# Altium schematic sheet 2.RELAY.SchDoc
size A4; SheetNumber: 2; SheetTotal: 5
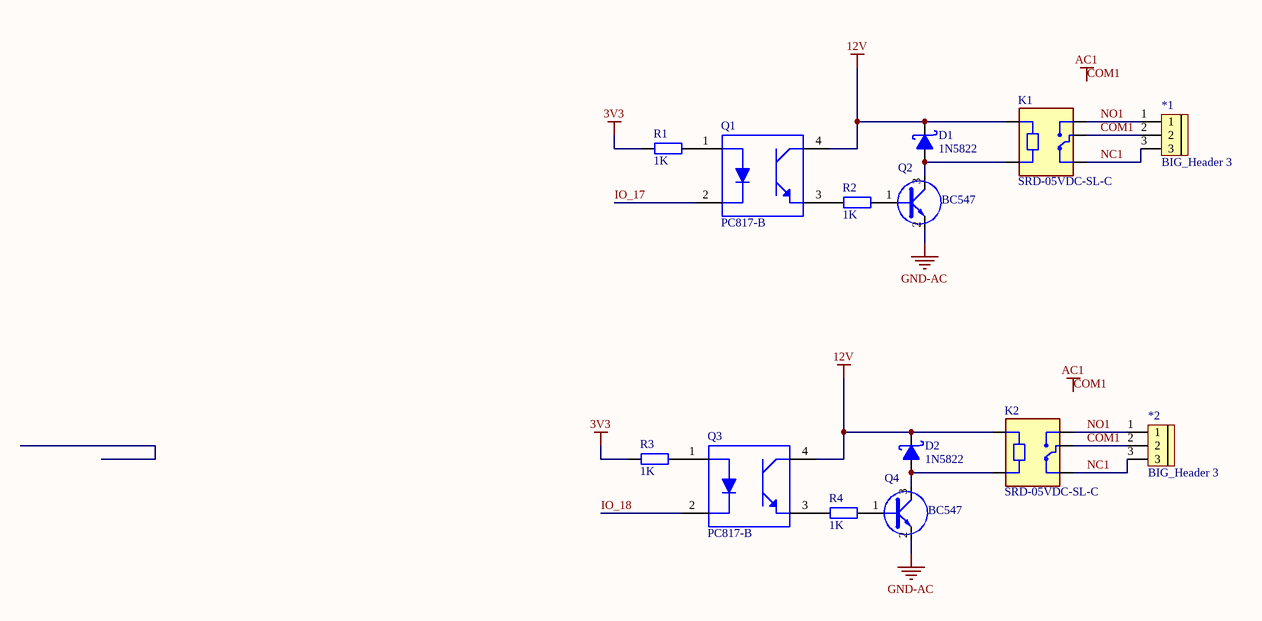
[diagram p0: 2.RELAY.SchDoc]

## Parts
*1  BIG_Header 3  [KF-128_3P]
*2  BIG_Header 3  [KF-128_3P]
D1  1N5822  [SMA]
D2  1N5822  [SMA]
K1  SRD-05VDC-SL-C  [RELAY_SRD-05VDC-SL-C]
K2  SRD-05VDC-SL-C  [RELAY_SRD-05VDC-SL-C]
Q1  PC817-B  [DIP762W50P254L650H455Q4B]
Q2  BC547  [TO-92]
Q3  PC817-B  [DIP762W50P254L650H455Q4B]
Q4  BC547  [TO-92]
R1  1K  [RES-SMD-0805]
R2  1K  [RES-SMD-0805]
R3  1K  [RES-SMD-0805]
R4  1K  [RES-SMD-0805]

## Nets
3V3: R1.2 R3.2
12V: D1.2(K) D2.2(K) K1.A1 K2.A1 Q1.4(COLLECTOR) Q3.4(COLLECTOR)
COM1: *1.2 *2.2 K1.COM K2.COM  [also labelled AC1]
GND-AC: Q2.2(E) Q4.2(E)
IO_17: Q1.2(CATHODE)
IO_18: Q3.2(CATHODE)
NC1: *1.3 *2.3 K1.NC K2.NC
NO1: *1.1 *2.1 K1.NO K2.NO
NetD1_1: D1.1(A) K1.A2 Q2.3(C)
NetD2_1: D2.1(A) K2.A2 Q4.3(C)
NetQ1_1: Q1.1(ANODE) R1.1
NetQ1_3: Q1.3(EMITTER) R2.2
NetQ2_1: Q2.1(B) R2.1
NetQ3_1: Q3.1(ANODE) R3.1
NetQ3_3: Q3.3(EMITTER) R4.2
NetQ4_1: Q4.1(B) R4.1

## Library data of the parts
D1 D2 = 1N5822: Schottky Rectifiers; Value: Diode c?m 1N5408
K1 K2 = SRD-05VDC-SL-C: https://linhkien.cxt.vn/3210-sra-12vdc-cl-songle-relay-20a-12vdc-5-chan.html; MF: Songle Relay; Check_prices: https://www.snapeda.com/parts/SRD-05VDC-SL-C/Songle+Relay/view-part/?ref=eda; Value: *; Availability: Not in stock; Price: None; Package: NON STANDARD-5 Songle Relay; MP: SRD-05VDC-SL-C; SnapEDA_Link: https://www.snapeda.com/parts/SRD-05VDC-SL-C/Songle+Relay/view-part/?ref=snap
Q1 Q3 = PC817-B: Phototransistors 4-DIP _0.300, 7.62mm_; MF: American Bright; SnapEDA_Link: https://www.snapeda.com/parts/PC817-B/American%20Bright/view-part/524587/?ref=snap; Availability: Unavailable; MP: PC817-B; Value: *; Price: None; Package: DIP-4 American Bright
Q2 Q4 = C1815: NPN 600mW, ECB; Value: C1815
R1-R4 = Resistor - SMD: Resistor SMD; Manufacturer: Generic Components; Class: Passive; Published: 08/06/2000; Publisher: Altium Hobart Technology Centre